# Altium schematic sheet Top.SchDoc
size A4
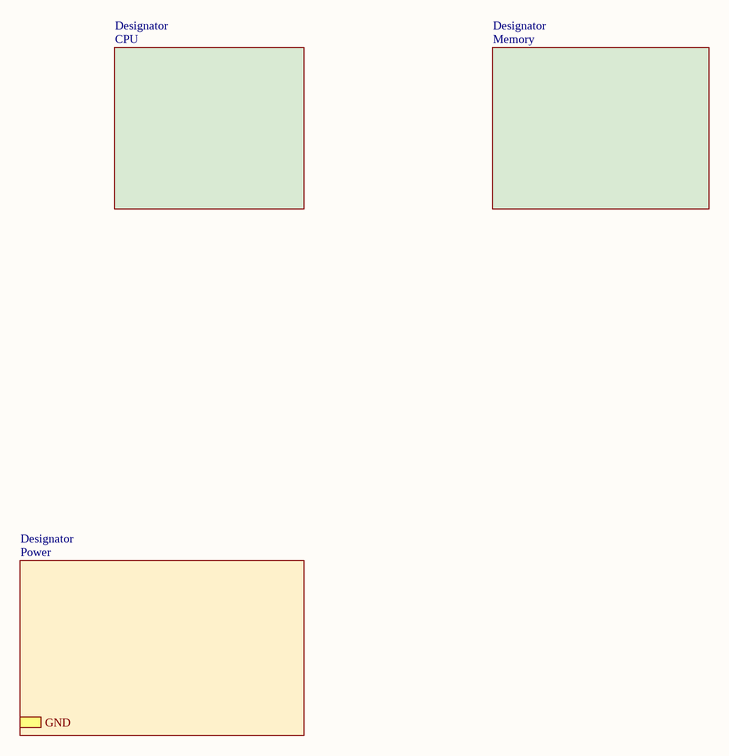
[diagram p0: Top.SchDoc]

## Sub-sheets
Designator = CPU: no entries
Designator = Memory: no entries
Designator = Power: GND